# Altium project VNA_CHANNEL.PrjPcb
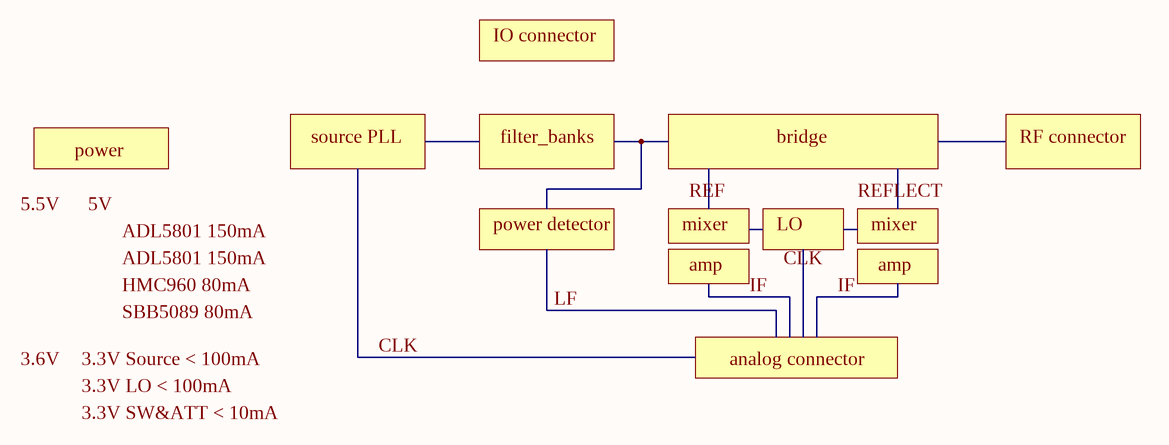
[diagram p0: block_diagram.SchDoc]
7 sheets, 186 parts. Net scope: flat (ports and power ports of the same name join across sheets).
Board file: VNA_CHANNEL.PcbDoc
Sheets:
  block_diagram.SchDoc
  power.SchDoc
  connector.SchDoc
  source.SchDoc
  filterbank_amp.SchDoc
  mixer.SchDoc
  IF_AMP.SchDoc

## Sheet block_diagram.SchDoc
size A4

### Notes on the sheet
- IO connector
- power
- source PLL
- filter_banks
- bridge
- RF connector
- 5.5V
- 5V
- ADL5801 150mA
- power detector
- mixer
- REF
- LO
- CLK
- REFLECT
- HMC960 80mA
- SBB5089 80mA
- LF
- amp
- IF
- 3.6V
- 3.3V Source < 100mA
- 3.3V LO < 100mA
- analog connector
- 3.3V SW&ATT < 10mA

## Sheet power.SchDoc
size A4
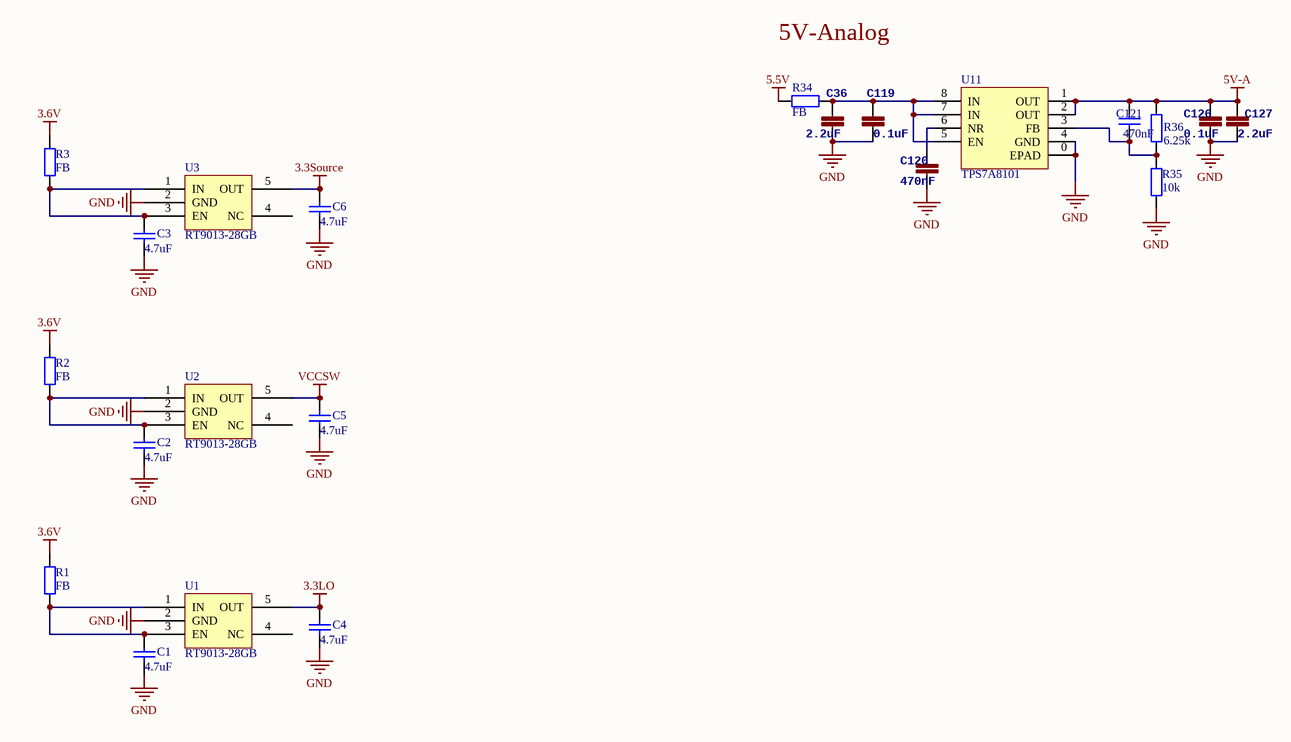
[diagram p1: power.SchDoc]

### Parts
C1  4.7uF  [0603L]
C2  4.7uF  [0603L]
C3  4.7uF  [0603L]
C4  4.7uF  [0603L]
C5  4.7uF  [0603L]
C6  4.7uF  [0603L]
C36  2.2uF  [0603L]
C119  0.1uF  [0402]
C120  470nF  [0402]
C121  470nF  [0402]
C126  0.1uF  [0603L]
C127  2.2uF  [0603L]
R1  FB  [0603L]
R2  FB  [0603L]
R3  FB  [0603L]
R34  FB  [0603L]
R35  10k  [0402]
R36  6.25k  [0402]
U1  RT9013-28GB  [SOT23-5]
U2  RT9013-28GB  [SOT23-5]
U3  RT9013-28GB  [SOT23-5]
U11  TPS7A8101  [TPS7A8101]

### Nets
3.3LO: C4.2 U1.5(OUT)
3.3Source: C6.2 U3.5(OUT)
3.6V: R1.2 R2.2 R3.2
5.5V: R34.2
5V-A: C121.1 C126.2 C127.2 R36.1 U11.1(OUT) U11.2(OUT)
GND: C1.1 C2.1 C3.1 C4.1 C5.1 C6.1 C36.1 C119.1 C120.1 C126.1 C127.1 R35.2 U1.2(GND) U2.2(GND) U3.2(GND) U11.0(EPAD) U11.4(GND)
VCCSW: C5.2 U2.5(OUT)
NetC1_2: C1.2 R1.1 U1.1(IN) U1.3(EN)
NetC2_2: C2.2 R2.1 U2.1(IN) U2.3(EN)
NetC3_2: C3.2 R3.1 U3.1(IN) U3.3(EN)
NetC36_2: C36.2 C119.2 R34.1 U11.5(EN) U11.7(IN) U11.8(IN)
NetC120_2: C120.2 U11.6(NR)
NetC121_2: C121.2 R35.1 R36.2 U11.3(FB)

Not connected (* = marked no-connect by the designer): U1 4(NC); U2 4(NC); U3 4(NC)

### Notes on the sheet
- 5V-Analog

### Library data of the parts
C1-C6 C121 = Cap: Capacitor; Published: 8-Jun-2000; LatestRevisionDate: 17-Jul-2002; LatestRevisionNote: Re-released for DXP Platform.; PackageReference: RAD-0.3; Publisher: Altium Limited; PackageDescription: Radial Cap, Thru-Hole; 2 Leads; 0.3 in Pin Spacing
C36 C119 C120 C126 C127 = CAP0402-CAP: <b>Capacitor</b> / Standard 0603 ceramic capacitor, and 0.1" leaded capacitor.; PARTNO: CC0402ZRY5V7BB104
R1-R3 R34-R36 = Res2: Resistor; Value: 0Ohm; Published: 8-Jun-2000; LatestRevisionDate: 17-Jul-2002; LatestRevisionNote: Re-released for DXP Platform.; PackageReference: AXIAL-0.4; Publisher: Altium Limited; PackageDescription: Axial Device, Thru-Hole; 2 Leads; 0.4 in Pin Spacing
U1-U3 = LP5907

## Sheet connector.SchDoc
size A4
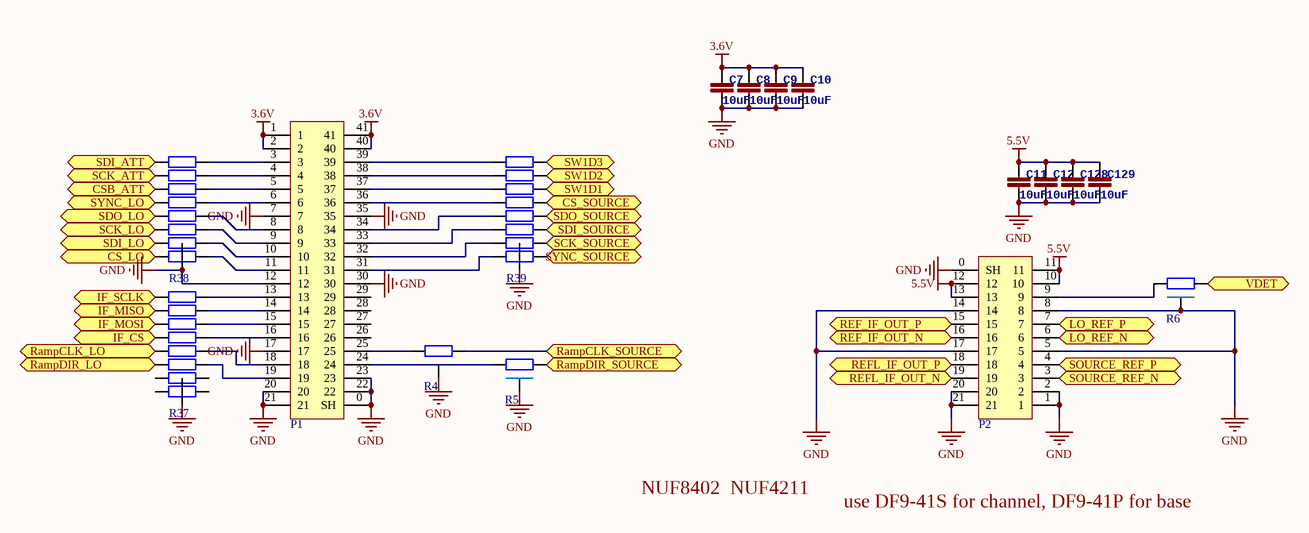
[diagram p2: connector.SchDoc]

### Parts
C7  10uF  [0603L]
C8  10uF  [0603L]
C9  10uF  [0603L]
C10  10uF  [0603L]
C11  10uF  [0603L]
C12  10uF  [0603L]
C128  10uF  [0603L]
C129  10uF  [0603L]
P1  DF9-41S  [DF9-41S]  (value not drawn)
P2  DF9-21  [DF9-21S]  (value not drawn)
R4  PiFilter  [PiFIiter]  (value not drawn)
R5  PiFilter  [PiFIiter]  (value not drawn)
R6  PiFilter  [PiFIiter]  (value not drawn)
R37  NUF8xxx  [NUF8xxx]  (value not drawn)
R38  NUF8xxx  [NUF8xxx]  (value not drawn)
R39  NUF8xxx  [NUF8xxx]  (value not drawn)

### Ports
CS_LO, CS_SOURCE, CSB_ATT, IF_CS, IF_MISO, IF_MOSI, IF_SCLK, LO_REF_N, LO_REF_P, RampCLK_LO, RampCLK_SOURCE, RampDIR_LO, RampDIR_SOURCE, REF_IF_OUT_N, REF_IF_OUT_P, REFL_IF_OUT_N, REFL_IF_OUT_P, SCK_ATT, SCK_LO, SCK_SOURCE, SDI_ATT, SDI_LO, SDI_SOURCE, SDO_LO, SDO_SOURCE, SOURCE_REF_N, SOURCE_REF_P, SW1D1, SW1D2, SW1D3, SYNC_LO, SYNC_SOURCE, VDET

### Nets
3.6V: C7.2 C8.2 C9.2 C10.2 P1.1 P1.2 P1.40 P1.41
5.5V: C11.2 C12.2 C128.2 C129.2 P2.10 P2.11 P2.12 P2.13
GND: C7.1 C8.1 C9.1 C10.1 C11.1 C12.1 C128.1 C129.1 P1.0(SH) P1.7 P1.12 P1.17 P1.20 P1.21 P1.22 P1.23 P1.30 P1.35 P2.0(SH) P2.1 P2.2 P2.5 P2.8 P2.14 P2.17 P2.20 P2.21 R4.3 R5.3 R6.3 R37.0 R38.0 R39.0
REF_IF_OUT_N: P2.16 ; port REF_IF_OUT_N
REF_IF_OUT_P: P2.15 ; port REF_IF_OUT_P
REFL_IF_OUT_N: P2.19 ; port REFL_IF_OUT_N
REFL_IF_OUT_P: P2.18 ; port REFL_IF_OUT_P
SOURCE_REF_N: P2.3 ; port SOURCE_REF_N
SOURCE_REF_P: P2.4 ; port SOURCE_REF_P
NetP1_3: P1.3 R38.16
NetP1_4: P1.4 R38.15
NetP1_5: P1.5 R38.14
NetP1_6: P1.6 R38.13
NetP1_8: P1.8 R38.12
NetP1_9: P1.9 R38.11
NetP1_10: P1.10 R38.10
NetP1_11: P1.11 R38.9
NetP1_13: P1.13 R37.16
NetP1_14: P1.14 R37.15
NetP1_15: P1.15 R37.14
NetP1_16: P1.16 R37.13
NetP1_18: P1.18 R37.12
NetP1_19: P1.19 R37.11
NetP1_24: P1.24 R5.1
NetP1_25: P1.25 R4.2
NetP1_31: P1.31 R39.8
NetP1_32: P1.32 R39.7
NetP1_33: P1.33 R39.6
NetP1_34: P1.34 R39.5
NetP1_36: P1.36 R39.4
NetP1_37: P1.37 R39.3
NetP1_38: P1.38 R39.2
NetP1_39: P1.39 R39.1
NetP2_6: P2.6 ; port LO_REF_N
NetP2_7: P2.7 ; port LO_REF_P
NetP2_9: P2.9 R6.2
NetR4_1: R4.1 ; port RampCLK_SOURCE
NetR5_2: R5.2 ; port RampDIR_SOURCE
NetR6_1: R6.1 ; port VDET
NetR24_2: R37.2 ; port IF_MISO
NetR37_1: R37.1 ; port IF_SCLK
NetR37_3: R37.3 ; port IF_MOSI
NetR37_4: R37.4 ; port IF_CS
NetR37_5: R37.5 ; port RampCLK_LO
NetR37_6: R37.6 ; port RampDIR_LO
NetR38_1: R38.1 ; port SDI_ATT
NetR38_2: R38.2 ; port SCK_ATT
NetR38_3: R38.3 ; port CSB_ATT
NetR38_4: R38.4 ; port SYNC_LO
NetR38_5: R38.5 ; port SDO_LO
NetR38_6: R38.6 ; port SCK_LO
NetR38_7: R38.7 ; port SDI_LO
NetR38_8: R38.8 ; port CS_LO
NetR39_9: R39.9 ; port SYNC_SOURCE
NetR39_10: R39.10 ; port SCK_SOURCE
NetR39_11: R39.11 ; port SDI_SOURCE
NetR39_12: R39.12 ; port SDO_SOURCE
NetR39_13: R39.13 ; port CS_SOURCE
NetR39_14: R39.14 ; port SW1D1
NetR39_15: R39.15 ; port SW1D2
NetR39_16: R39.16 ; port SW1D3

Not connected (* = marked no-connect by the designer): P1 26 27 28 29; R37 7 8 9 10

### Notes on the sheet
- NUF8402  NUF4211
- use DF9-41S for channel, DF9-41P for base

### Library data of the parts
C7-C12 C128 C129 = CAP0402-CAP: as C36 on sheet power

## Sheet source.SchDoc
size A4
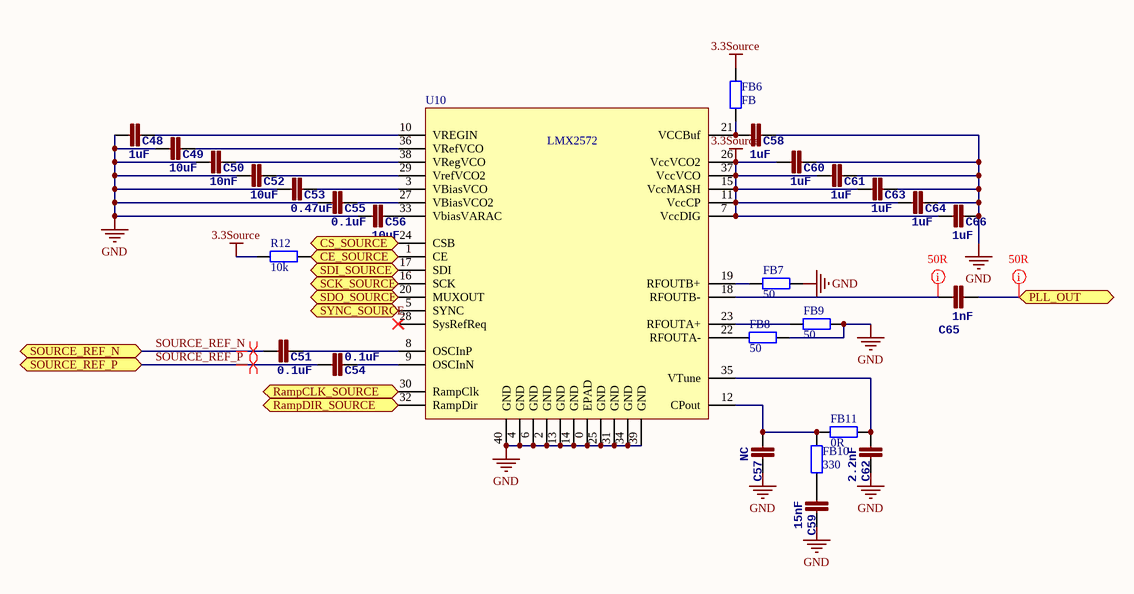
[diagram p3: source.SchDoc]

### Parts
C48  1uF  [0201]
C49  10uF  [0402]
C50  10nF  [0201]
C51  0.1uF  [0201]
C52  10uF  [0402]
C53  0.47uF  [0402]
C54  0.1uF  [0201]
C55  0.1uF  [0201]
C56  10uF  [0402]
C57  NC  [0201]
C58  1uF  [0201]
C59  15nF  [0201]
C60  1uF  [0201]
C61  1uF  [0201]
C62  2.2nF  [0201]
C63  1uF  [0201]
C64  1uF  [0201]
C65  1nF  [0402]
C66  1uF  [0201]
FB6  FB  [0402]
FB7  50  [0201]
FB8  50  [0201]
FB9  50  [0201]
FB10  330  [0201]
FB11  0R  [0201]
R12  10k  [0402]
U10  LMX2572  [LMX2572]

### Ports
CE_SOURCE, CS_SOURCE, PLL_OUT, RampCLK_SOURCE, RampDIR_SOURCE, SCK_SOURCE, SDI_SOURCE, SDO_SOURCE, SOURCE_REF_N, SOURCE_REF_P, SYNC_SOURCE

### Nets
3.3Source: C60.1 C61.1 C63.1 C64.1 C66.1 FB6.1 R12.1 U10.7(VccDIG) U10.11(VccCP) U10.15(VccMASH) U10.26(VccVCO2) U10.37(VccVCO)
GND: C48.1 C49.1 C50.1 C52.1 C53.1 C55.1 C56.1 C57.2 C58.2 C59.2 C60.2 C61.2 C62.2 C63.2 C64.2 C66.2 FB7.1 FB8.1 FB9.1 U10.0(EPAD) U10.2(GND) U10.4(GND) U10.6(GND) U10.13(GND) U10.14(GND) U10.25(GND) U10.31(GND) U10.34(GND) U10.39(GND) U10.40(GND)
SOURCE_REF_N: C51.1 ; port SOURCE_REF_N
SOURCE_REF_P: C54.1 ; port SOURCE_REF_P
NetC48_2: C48.2 U10.10(VREGIN)
NetC49_2: C49.2 U10.36(VRefVCO)
NetC50_2: C50.2 U10.38(VRegVCO)
NetC51_2: C51.2 U10.8(OSCInP)
NetC52_2: C52.2 U10.29(VrefVCO2)
NetC53_2: C53.2 U10.3(VBiasVCO)
NetC54_2: C54.2 U10.9(OSCInN)
NetC55_2: C55.2 U10.27(VBiasVCO2)
NetC56_2: C56.2 U10.33(VbiasVARAC)
NetC57_1: C57.1 FB10.2 FB11.2 U10.12(CPout)
NetC58_1: C58.1 FB6.2 U10.21(VCCBuf)
NetC59_1: C59.1 FB10.1
NetC62_1: C62.1 FB11.1 U10.35(VTune)
NetC65_1: C65.1 U10.18(RFOUTB-)
NetC65_2: C65.2 ; port PLL_OUT
NetFB7_2: FB7.2 U10.19(RFOUTB+)
NetFB8_2: FB8.2 U10.22(RFOUTA-)
NetFB9_2: FB9.2 U10.23(RFOUTA+)
NetR4_1: U10.30(RampClk) ; port RampCLK_SOURCE
NetR5_2: U10.32(RampDir) ; port RampDIR_SOURCE
NetR12_2: R12.2 U10.1(CE) ; port CE_SOURCE
NetR39_9: U10.5(SYNC) ; port SYNC_SOURCE
NetR39_10: U10.16(SCK) ; port SCK_SOURCE
NetR39_11: U10.17(SDI) ; port SDI_SOURCE
NetR39_12: U10.20(MUXOUT) ; port SDO_SOURCE
NetR39_13: U10.24(CSB) ; port CS_SOURCE

Not connected (* = marked no-connect by the designer): U10 28(SysRefReq)*

### Layout directives
net class 50R: NetC65_1, NetC65_2
differential pair: SOURCE_REF_N, SOURCE_REF_P

### Library data of the parts
C48-C66 = CAP0402-CAP: as C36 on sheet power
FB6-FB11 R12 = Res2: Resistor; Published: 8-Jun-2000; LatestRevisionDate: 17-Jul-2002; LatestRevisionNote: Re-released for DXP Platform.; PackageReference: AXIAL-0.4; Publisher: Altium Limited; PackageDescription: Axial Device, Thru-Hole; 2 Leads; 0.4 in Pin Spacing

## Sheet filterbank_amp.SchDoc
size A3
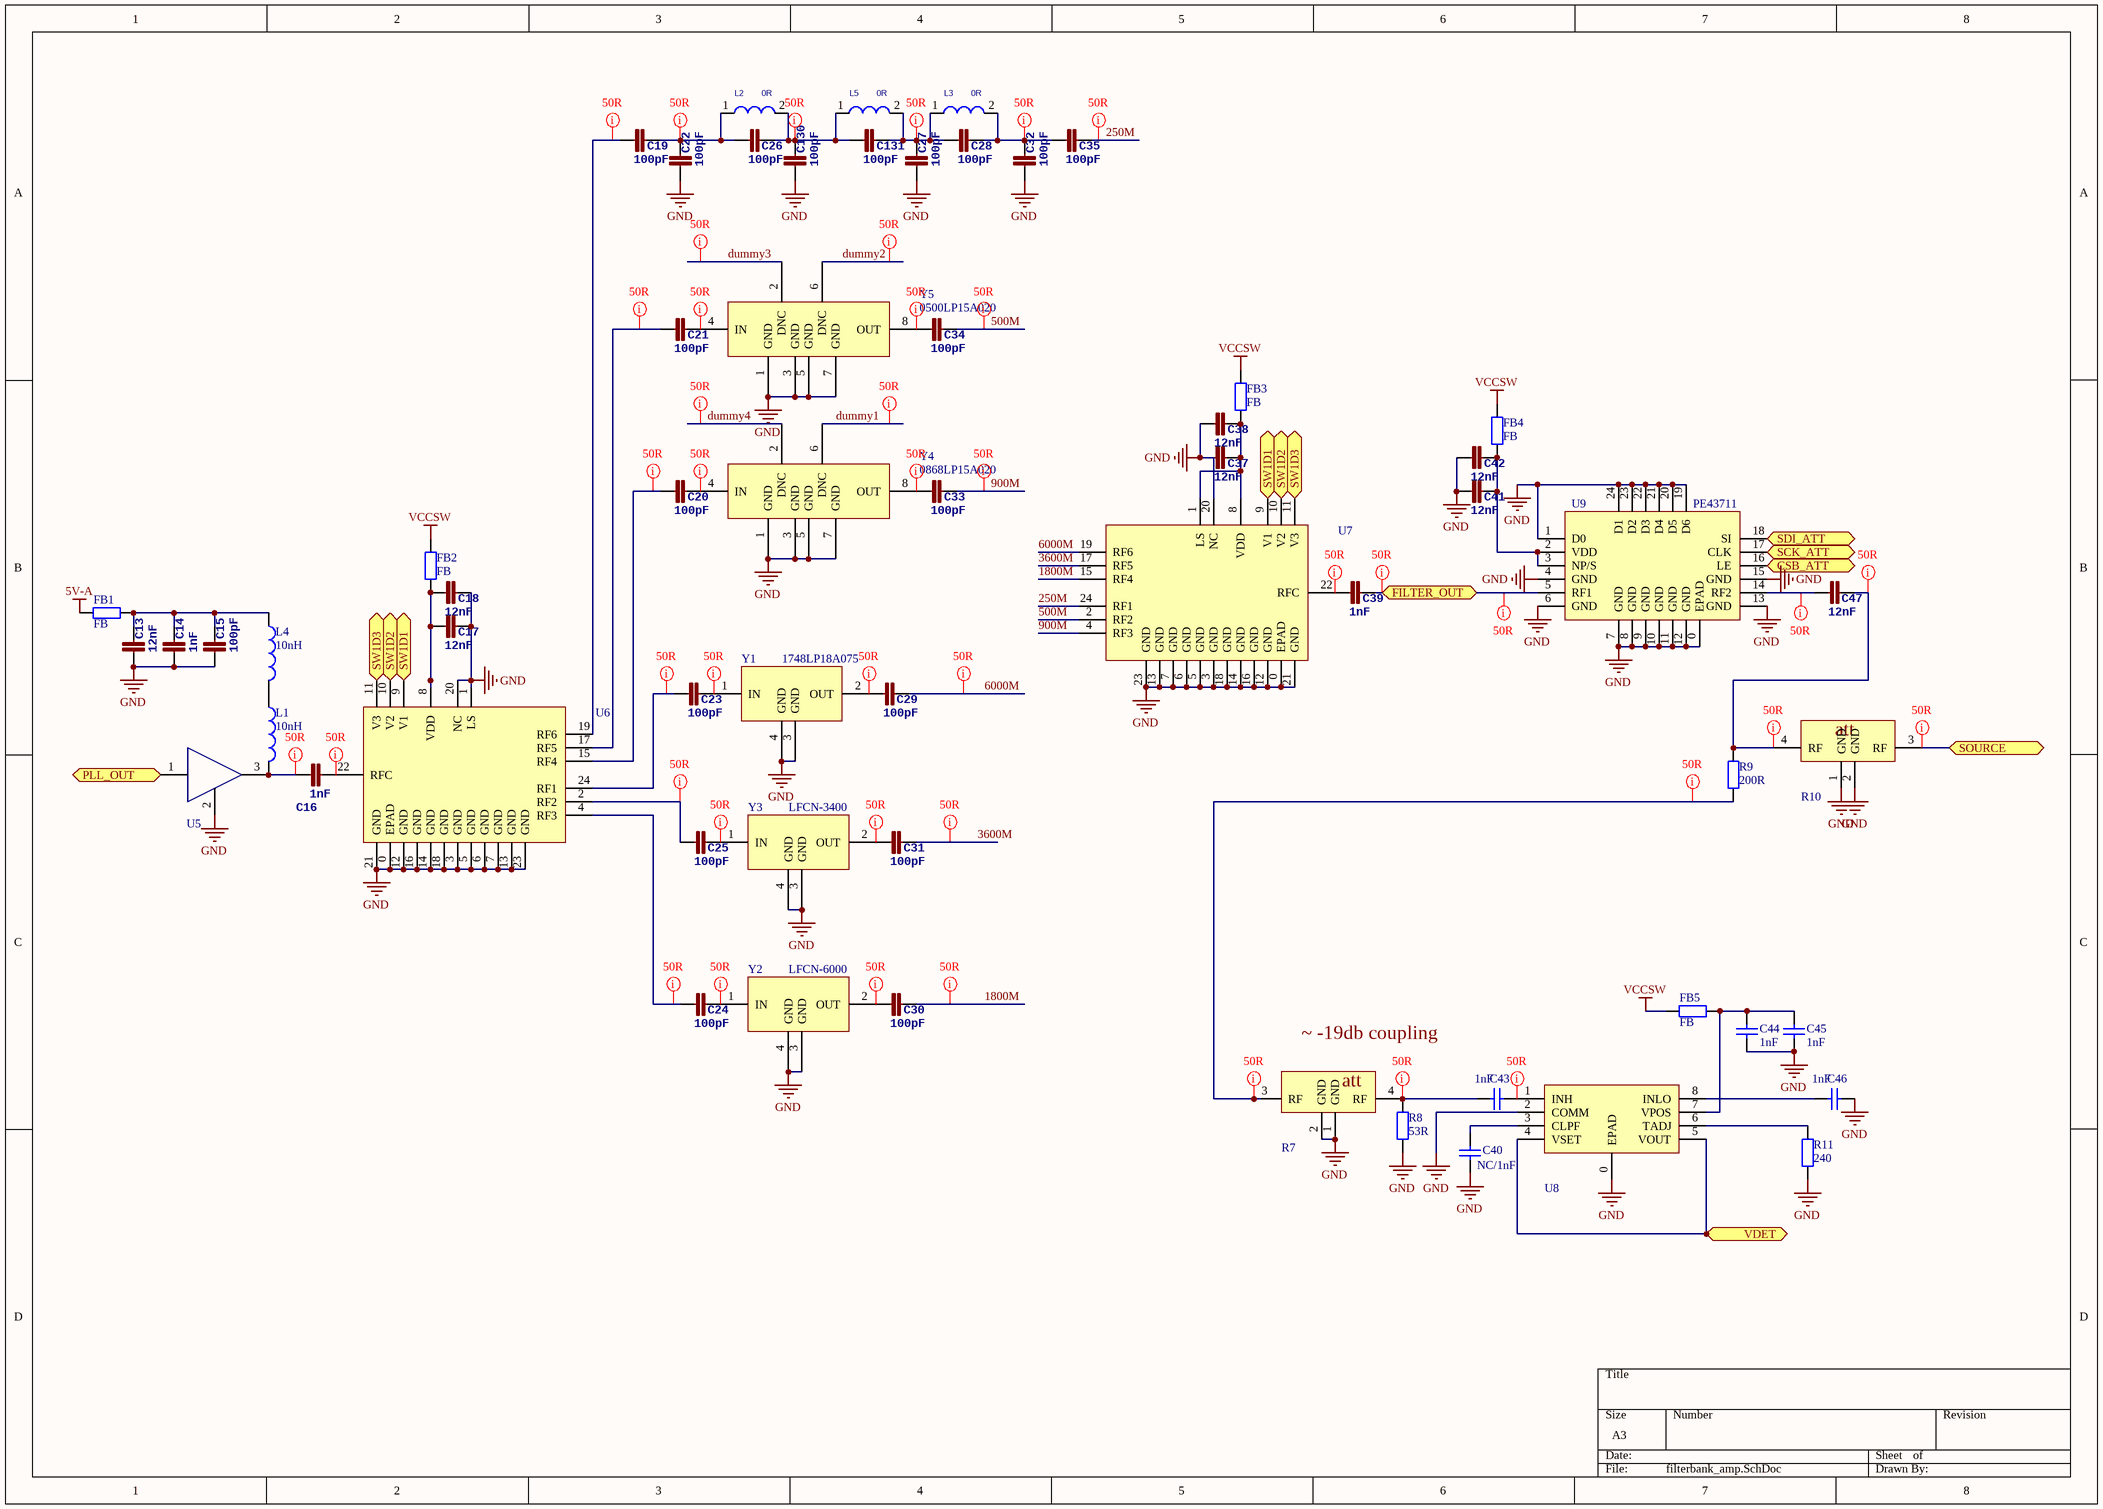
[diagram p4: filterbank_amp.SchDoc]

### Parts
C13  12nF  [0805]
C14  1nF  [0402]
C15  100pF  [0402]
C16  1nF  [0402]
C17  12nF  [0402]
C18  12nF  [0402]
C19  100pF  [0402]
C20  100pF  [0402]
C21  100pF  [0402]
C22  100pF  [0402]
C23  100pF  [0402]
C24  100pF  [0402]
C25  100pF  [0402]
C26  100pF  [0402]
C27  100pF  [0402]
C28  100pF  [0402]
C29  100pF  [0402]
C30  100pF  [0402]
C31  100pF  [0402]
C32  100pF  [0402]
C33  100pF  [0402]
C34  100pF  [0402]
C35  100pF  [0402]
C37  12nF  [0402]
C38  12nF  [0402]
C39  1nF  [0402]
C40  NC/1nF  [0402]
C41  12nF  [0402]
C42  12nF  [0402]
C43  1nF  [0402]
C44  1nF  [0402]
C45  1nF  [0402]
C46  1nF  [0402]
C47  12nF  [0201]
C130  100pF  [0402]
C131  100pF  [0402]
FB1  FB  [0402]
FB2  FB  [0402]
FB3  FB  [0402]
FB4  FB  [0402]
FB5  FB  [0402]
L1  value 10nH  [0402]  (hidden comment: Inductor)
L2  0R  [0402]
L3  0R  [0402]
L4  value 10nH  [0603]  (hidden comment: Inductor)
L5  0R  [0402]
R7  EXB24-RF-ATT  [EXB24AT-RF-ATT]  (value not drawn)
R8  53R  [0402]
R9  200R  [0201]
R10  EXB24-RF-ATT  [EXB24AT-RF-ATT]  (value not drawn)
R11  240  [0402]
U5  AMP-SOT89  [SOT-89]  (value not drawn)
U6  PE42462  [PE42462]  (value not drawn)
U7  PE42462  [PE42462]  (value not drawn)
U8  AD8319  [AD8319]  (value not drawn)
U9  PE43711  [PE43711]
Y1  1748LP18A075  [1748LP18A075]
Y2  LFCN-6000  [1748LP18A075]
Y3  LFCN-3400  [1748LP18A075]
Y4  0868LP15A020  [5515LP15A730/0868LP15A020]
Y5  0500LP15A020  [5515LP15A730/0868LP15A020]

### Ports
CSB_ATT, FILTER_OUT, PLL_OUT, SCK_ATT, SDI_ATT, SOURCE, SW1D1, SW1D2, SW1D3, VDET

### Nets
5V-A: FB1.1
GND: C13.1 C14.1 C15.1 C17.2 C18.2 C22.1 C27.1 C32.1 C37.1 C38.1 C40.1 C41.1 C42.1 C44.1 C45.1 C46.2 C130.1 R7.1(GND) R7.2(GND) R8.2 R10.1(GND) R10.2(GND) R11.2 U5.2 U6.0(EPAD) U6.1(LS) U6.3(GND) U6.5(GND) U6.6(GND) U6.7(GND) U6.12(GND) U6.13(GND) U6.14(GND) U6.16(GND) U6.18(GND) U6.20(NC) U6.21(GND) U6.23(GND) U7.0(EPAD) U7.3(GND) U7.5(GND) U7.6(GND) U7.7(GND) U7.12(GND) U7.13(GND) U7.14(GND) U7.16(GND) U7.18(GND) U7.20(NC) U7.21(GND) U7.23(GND) U8.0(EPAD) U8.2(COMM) U9.0(EPAD) U9.1(D0) U9.4(GND) U9.6(GND) U9.7(GND) U9.8(GND) U9.9(GND) U9.10(GND) U9.11(GND) U9.12(GND) U9.13(GND) U9.15(GND) U9.19(D6) U9.20(D5) U9.21(D4) U9.22(D3) U9.23(D2) U9.24(D1) Y1.3(GND) Y1.4(GND) Y2.3(GND) Y2.4(GND) Y3.3(GND) Y3.4(GND) Y4.1(GND) Y4.3(GND) Y4.5(GND) Y4.7(GND) Y5.1(GND) Y5.3(GND) Y5.5(GND) Y5.7(GND)
VCCSW: FB2.2 FB3.2 FB4.2 FB5.1
250M: C35.2 U7.24(RF1)
500M: C34.2 U7.2(RF2)
900M: C33.2 U7.4(RF3)
1800M: C30.2 U7.15(RF4)
3600M: C31.2 U7.17(RF5)
6000M: C29.2 U7.19(RF6)
dummy1: Y4.6(DNC)
dummy2: Y5.6(DNC)
dummy3: Y5.2(DNC)
dummy4: Y4.2(DNC)
NetC13_2: C13.2 C14.2 C15.2 FB1.2 L4.1
NetC16_1: C16.1 L1.2 U5.3
NetC16_2: C16.2 U6.22(RFC)
NetC17_1: C17.1 C18.1 FB2.1 U6.8(VDD)
NetC19_1: C19.1 U6.19(RF6)
NetC19_2: C19.2 C22.2 C26.1 L2.1
NetC20_1: C20.1 U6.15(RF4)
NetC20_2: C20.2 Y4.4(IN)
NetC21_1: C21.1 U6.17(RF5)
NetC21_2: C21.2 Y5.4(IN)
NetC23_1: C23.1 U6.24(RF1)
NetC23_2: C23.2 Y1.1(IN)
NetC24_1: C24.1 U6.4(RF3)
NetC24_2: C24.2 Y2.1(IN)
NetC25_1: C25.1 U6.2(RF2)
NetC25_2: C25.2 Y3.1(IN)
NetC26_2: C26.2 C130.2 C131.1 L2.2 L5.1
NetC27_2: C27.2 C28.1 C131.2 L3.1 L5.2
NetC28_2: C28.2 C32.2 C35.1 L3.2
NetC29_1: C29.1 Y1.2(OUT)
NetC30_1: C30.1 Y2.2(OUT)
NetC31_1: C31.1 Y3.2(OUT)
NetC33_1: C33.1 Y4.8(OUT)
NetC34_1: C34.1 Y5.8(OUT)
NetC37_2: C37.2 C38.2 FB3.1 U7.1(LS) U7.8(VDD)
NetC39_1: C39.1 U7.22(RFC)
NetC39_2: C39.2 U9.5(RF1) ; port FILTER_OUT
NetC40_2: C40.2 U8.3(CLPF)
NetC41_2: C41.2 C42.2 FB4.1 U9.2(VDD) U9.3(NP/S)
NetC43_1: C43.1 R7.4(RF) R8.1
NetC43_2: C43.2 U8.1(INH)
NetC44_2: C44.2 C45.2 FB5.2 U8.7(VPOS)
NetC46_1: C46.1 U8.8(INLO)
NetC47_1: C47.1 U9.14(RF2)
NetC47_2: C47.2 R9.1 R10.4(RF)
NetC65_2: U5.1 ; port PLL_OUT
NetL1_1: L1.1 L4.2
NetR6_1: U8.4(VSET) U8.5(VOUT) ; port VDET
NetR7_3: R7.3(RF) R9.2
NetR10_3: R10.3(RF) ; port SOURCE
NetR11_1: R11.1 U8.6(TADJ)
NetR38_1: U9.18(SI) ; port SDI_ATT
NetR38_2: U9.17(CLK) ; port SCK_ATT
NetR38_3: U9.16(LE) ; port CSB_ATT
NetR39_14: U6.9(V1) U7.9(V1) ; port SW1D1
NetR39_15: U6.10(V2) U7.10(V2) ; port SW1D2
NetR39_16: U6.11(V3) U7.11(V3) ; port SW1D3

### Layout directives
net class 50R: 250M, 500M, 900M, 1800M, 3600M, 6000M, dummy1, dummy2, dummy3, dummy4, NetC16_1, NetC16_2, NetC19_1, NetC19_2, NetC20_1, NetC20_2, NetC21_1, NetC21_2, NetC23_1, NetC23_2, NetC24_1, NetC24_2, NetC25_1, NetC25_2, NetC26_2, NetC27_2, NetC28_2, NetC29_1, NetC30_1, NetC31_1, NetC33_1, NetC34_1, NetC39_1, NetC39_2, NetC43_1, NetC43_2, NetC47_1, NetC47_2, NetR7_3, NetR10_3

### Notes on the sheet
- ~ -19db coupling
- (in symbol EXB24-RF-ATT) att

### Library data of the parts
C13-C35 C37-C39 C41 C42 C47 C130 C131 = CAP0402-CAP: as C36 on sheet power
C40 C43-C46 = Cap: Capacitor; Published: 8-Jun-2000; LatestRevisionDate: 17-Jul-2002; LatestRevisionNote: Re-released for DXP Platform.; PackageReference: RAD-0.3; Publisher: Altium Limited; PackageDescription: Radial Cap, Thru-Hole; 2 Leads; 0.3 in Pin Spacing
FB1-FB5 R8 R9 R11 = Res2: Resistor; Published: 8-Jun-2000; LatestRevisionDate: 17-Jul-2002; LatestRevisionNote: Re-released for DXP Platform.; PackageReference: AXIAL-0.4; Publisher: Altium Limited; PackageDescription: Axial Device, Thru-Hole; 2 Leads; 0.4 in Pin Spacing
L1 L4 = Inductor: Code_IEC: 1005; Published: 8-Jun-2000; LatestRevisionDate: 29-May-2009; LatestRevisionNote: IPC-7351 Footprint Added.; PackageReference: 0402-A; Publisher: Altium Limited; PackageDescription: Chip Inductor; Code_JEITA: 0402
L2 L3 L5 = L/2.5*2.0
Y2 Y3 = 1748LP18A075
Y4 Y5 = 5515LP15A730/0868LP15A020

## Sheet mixer.SchDoc
size A4
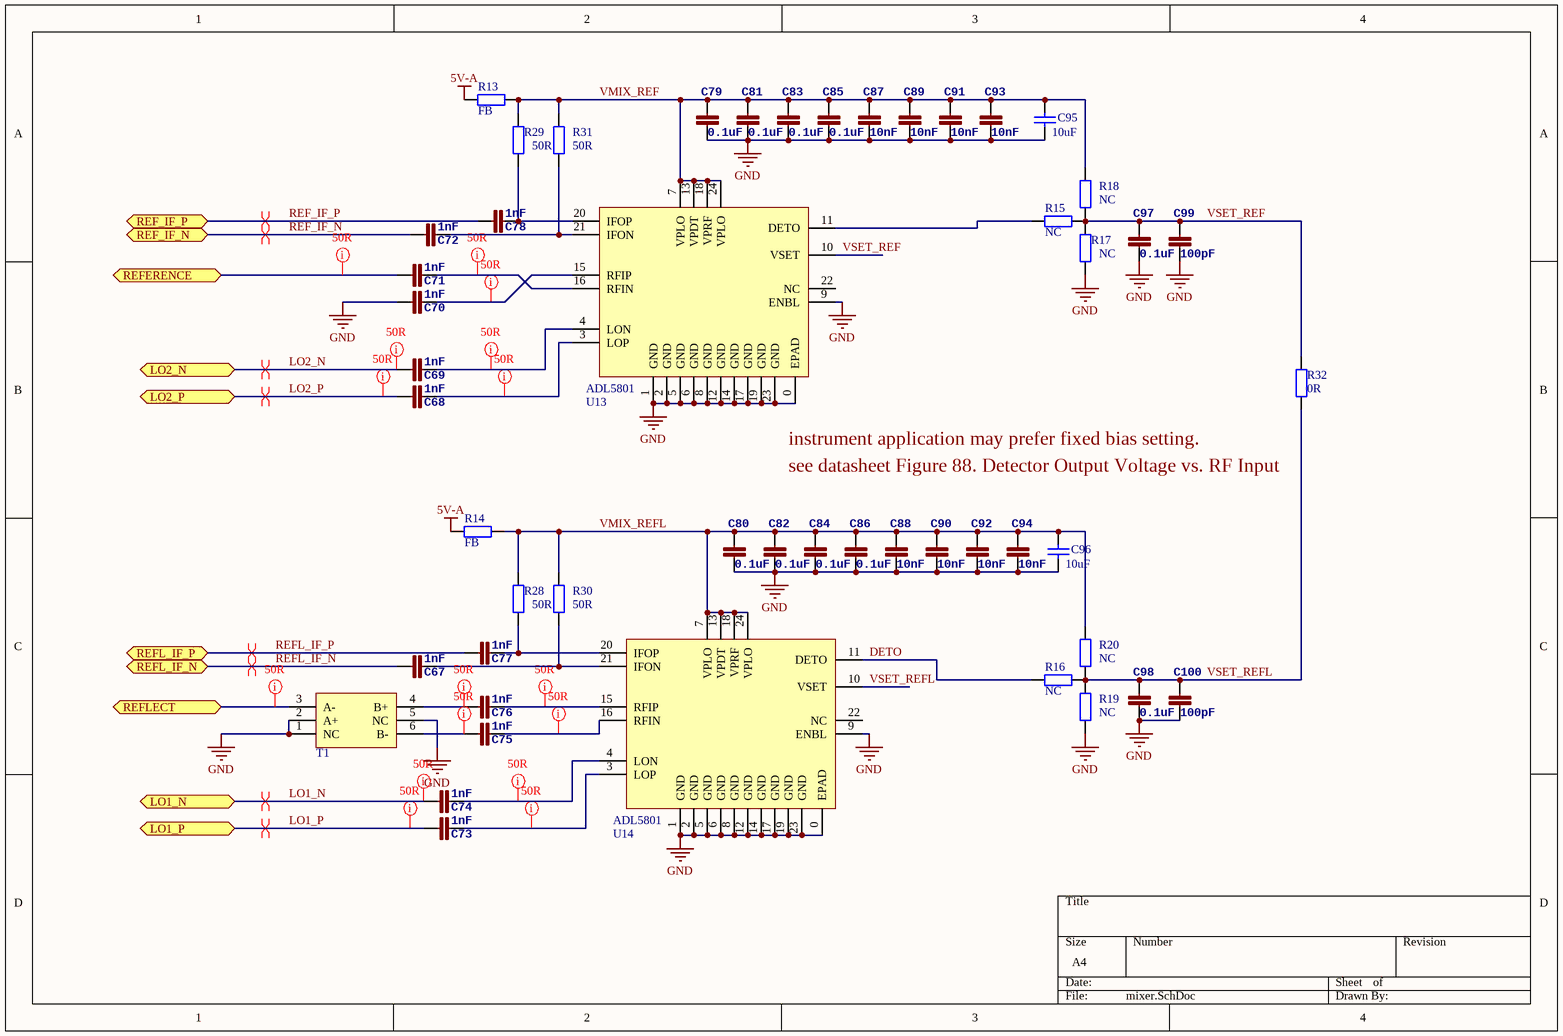
[diagram p5: mixer.SchDoc]

### Parts
C67  1nF  [0402]
C68  1nF  [0402]
C69  1nF  [0402]
C70  1nF  [0402]
C71  1nF  [0402]
C72  1nF  [0402]
C73  1nF  [0402]
C74  1nF  [0402]
C75  1nF  [0402]
C76  1nF  [0402]
C77  1nF  [0402]
C78  1nF  [0402]
C79  0.1uF  [0402]
C80  0.1uF  [0402]
C81  0.1uF  [0402]
C82  0.1uF  [0402]
C83  0.1uF  [0402]
C84  0.1uF  [0402]
C85  0.1uF  [0402]
C86  0.1uF  [0402]
C87  10nF  [0402]
C88  10nF  [0402]
C89  10nF  [0402]
C90  10nF  [0402]
C91  10nF  [0402]
C92  10nF  [0402]
C93  10nF  [0402]
C94  10nF  [0402]
C95  10uF  [0805]
C96  10uF  [0805]
C97  0.1uF  [0402]
C98  0.1uF  [0402]
C99  100pF  [0402]
C100  100pF  [0402]
R13  FB  [0603]
R14  FB  [0603]
R15  NC  [0402]
R16  NC  [0402]
R17  NC  [0402]
R18  NC  [0402]
R19  NC  [0402]
R20  NC  [0402]
R28  50R  [0402]
R29  50R  [0402]
R30  50R  [0402]
R31  50R  [0402]
R32  0R  [0402]
T1  TCM1-63AX+  [TCM1-63AX+]  (value not drawn)
U13  ADL5801  [ADL5801]
U14  ADL5801  [ADL5801]

### Ports
LO1_N, LO1_P, LO2_N, LO2_P, REF_IF_N, REF_IF_P, REFERENCE, REFL_IF_N, REFL_IF_P, REFLECT

### Nets
5V-A: R13.1 R14.1
GND: C70.1 C79.1 C80.1 C81.1 C82.1 C83.1 C84.1 C85.1 C86.1 C87.1 C88.1 C89.1 C90.1 C91.1 C92.1 C93.1 C94.1 C95.1 C96.1 C97.1 C98.1 C99.1 C100.1 R17.1 R19.1 T1.1(NC) T1.2(A+) T1.5(NC) U13.0(EPAD) U13.1(GND) U13.2(GND) U13.5(GND) U13.6(GND) U13.8(GND) U13.9(ENBL) U13.12(GND) U13.14(GND) U13.17(GND) U13.19(GND) U13.23(GND) U14.0(EPAD) U14.1(GND) U14.2(GND) U14.5(GND) U14.6(GND) U14.8(GND) U14.9(ENBL) U14.12(GND) U14.14(GND) U14.17(GND) U14.19(GND) U14.23(GND)
DETO: R16.2 U14.11(DETO)
LO1_N: C74.1 ; port LO1_N
LO1_P: C73.1 ; port LO1_P
LO2_N: C69.1 ; port LO2_N
LO2_P: C68.1 ; port LO2_P
REF_IF_N: C72.1 ; port REF_IF_N
REF_IF_P: C78.1 ; port REF_IF_P
REFL_IF_N: C67.1 ; port REFL_IF_N
REFL_IF_P: C77.1 ; port REFL_IF_P
VMIX_REF: C79.2 C81.2 C83.2 C85.2 C87.2 C89.2 C91.2 C93.2 C95.2 R13.2 R18.2 R29.2 R31.2 U13.7(VPLO) U13.13(VPDT) U13.18(VPRF) U13.24(VPLO)
VMIX_REFL: C80.2 C82.2 C84.2 C86.2 C88.2 C90.2 C92.2 C94.2 C96.2 R14.2 R20.2 R28.2 R30.2 U14.7(VPLO) U14.13(VPDT) U14.18(VPRF) U14.24(VPLO)
VSET_REF: C97.2 C99.2 R15.1 R17.2 R18.1 R32.1 U13.10(VSET)
VSET_REFL: C98.2 C100.2 R16.1 R19.2 R20.1 R32.2 U14.10(VSET)
NetC67_2: C67.2 R30.1 U14.21(IFON)
NetC68_2: C68.2 U13.3(LOP)
NetC69_2: C69.2 U13.4(LON)
NetC70_2: C70.2 U13.15(RFIP)
NetC71_1: C71.1 ; port REFERENCE
NetC71_2: C71.2 U13.16(RFIN)
NetC72_2: C72.2 R31.1 U13.21(IFON)
NetC73_2: C73.2 U14.3(LOP)
NetC74_2: C74.2 U14.4(LON)
NetC75_1: C75.1 T1.6(B-)
NetC75_2: C75.2 U14.16(RFIN)
NetC76_1: C76.1 T1.4(B+)
NetC76_2: C76.2 U14.15(RFIP)
NetC77_2: C77.2 R28.1 U14.20(IFOP)
NetC78_2: C78.2 R29.1 U13.20(IFOP)
NetR15_2: R15.2 U13.11(DETO)
NetT1_3: T1.3(A-) ; port REFLECT

Not connected (* = marked no-connect by the designer): U13 22(NC); U14 22(NC)

### Layout directives
differential pair: LO1_N, LO1_P, LO2_N, LO2_P, REF_IF_N, REF_IF_P, REFL_IF_N, REFL_IF_P
net class 50R: LO1_N, LO1_P, LO2_N, LO2_P, NetC68_2, NetC69_2, NetC70_2, NetC71_1, NetC71_2, NetC73_2, NetC74_2, NetC75_1, NetC75_2, NetC76_1, NetC76_2, NetT1_3

### Notes on the sheet
- instrument application may prefer fixed bias setting.
- see datasheet Figure 88. Detector Output Voltage vs. RF Input

### Library data of the parts
C67-C94 C97-C100 = CAP0402-CAP: as C36 on sheet power
C95 C96 = Cap: Capacitor; Published: 8-Jun-2000; LatestRevisionDate: 17-Jul-2002; LatestRevisionNote: Re-released for DXP Platform.; PackageReference: RAD-0.3; Publisher: Altium Limited; PackageDescription: Radial Cap, Thru-Hole; 2 Leads; 0.3 in Pin Spacing
R13 R14 = Res2: Resistor; Value: 0Ohm; Published: 8-Jun-2000; LatestRevisionDate: 17-Jul-2002; LatestRevisionNote: Re-released for DXP Platform.; PackageReference: AXIAL-0.4; Publisher: Altium Limited; PackageDescription: Axial Device, Thru-Hole; 2 Leads; 0.4 in Pin Spacing
R15-R20 R28-R32 = Res2: Resistor; Published: 8-Jun-2000; LatestRevisionDate: 17-Jul-2002; LatestRevisionNote: Re-released for DXP Platform.; PackageReference: AXIAL-0.4; Publisher: Altium Limited; PackageDescription: Axial Device, Thru-Hole; 2 Leads; 0.4 in Pin Spacing

## Sheet IF_AMP.SchDoc
size A4
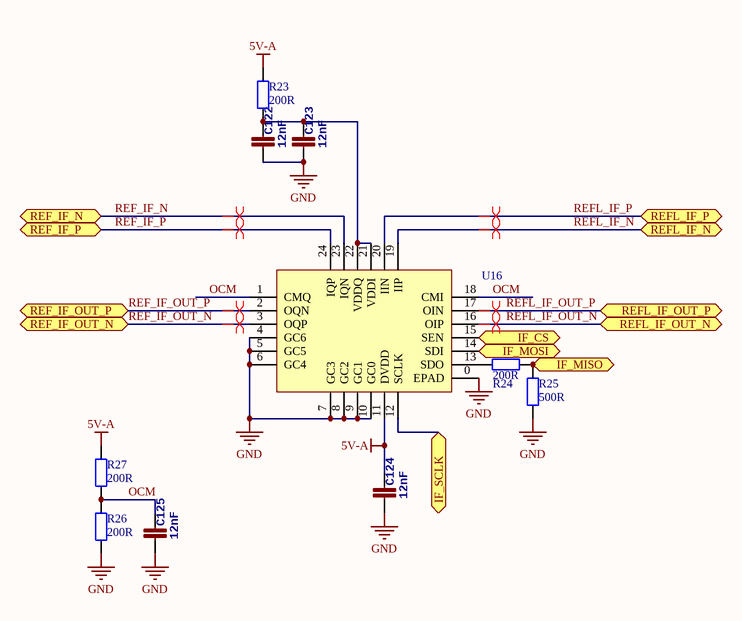
[diagram p6: IF_AMP.SchDoc]

### Parts
C122  12nF  [0402]
C123  12nF  [0402]
C124  12nF  [0402]
C125  12nF  [0402]
R23  200R  [0402]
R24  200R  [0402]
R25  500R  [0402]
R26  200R  [0402]
R27  200R  [0402]
U16  HMC960  [HMC960]  (value not drawn)

### Ports
IF_CS, IF_MISO, IF_MOSI, IF_SCLK, REF_IF_N, REF_IF_OUT_N, REF_IF_OUT_P, REF_IF_P, REFL_IF_N, REFL_IF_OUT_N, REFL_IF_OUT_P, REFL_IF_P

### Nets
5V-A: C124.2 R23.1 R27.1 U16.11(DVDD)
GND: C122.1 C123.1 C124.1 C125.1 R25.1 R26.2 U16.0(EPAD) U16.4(GC6) U16.5(GC5) U16.6(GC4) U16.7(GC3) U16.8(GC2) U16.9(GC1) U16.10(GC0)
OCM: C125.2 R26.1 R27.2 U16.1(CMQ) U16.18(CMI)
REF_IF_N: U16.23(IQN) ; port REF_IF_N
REF_IF_OUT_N: U16.3(OQP) ; port REF_IF_OUT_N
REF_IF_OUT_P: U16.2(OQN) ; port REF_IF_OUT_P
REF_IF_P: U16.24(IQP) ; port REF_IF_P
REFL_IF_N: U16.19(IIP) ; port REFL_IF_N
REFL_IF_OUT_N: U16.16(OIP) ; port REFL_IF_OUT_N
REFL_IF_OUT_P: U16.17(OIN) ; port REFL_IF_OUT_P
REFL_IF_P: U16.20(IIN) ; port REFL_IF_P
NetC122_2: C122.2 C123.2 R23.2 U16.21(VDDI) U16.22(VDDQ)
NetR24_1: R24.1 U16.13(SDO)
NetR24_2: R24.2 R25.2 ; port IF_MISO
NetR37_1: U16.12(SCLK) ; port IF_SCLK
NetR37_3: U16.14(SDI) ; port IF_MOSI
NetR37_4: U16.15(SEN) ; port IF_CS

### Layout directives
differential pair: REF_IF_N, REF_IF_OUT_N, REF_IF_OUT_P, REF_IF_P, REFL_IF_N, REFL_IF_OUT_N, REFL_IF_OUT_P, REFL_IF_P

### Library data of the parts
C122-C125 = CAP0402-CAP: as C36 on sheet power
R23-R27 = Res2: Resistor; Published: 8-Jun-2000; LatestRevisionDate: 17-Jul-2002; LatestRevisionNote: Re-released for DXP Platform.; PackageReference: AXIAL-0.4; Publisher: Altium Limited; PackageDescription: Axial Device, Thru-Hole; 2 Leads; 0.4 in Pin Spacing

## Nets that join several sheets
3.3Source: power (C6.2 U3.5), source (12 pins)
3.6V: power (R1.2 R2.2 R3.2), connector (8 pins)
5.5V: power (R34.2), connector (8 pins)
5V-A: power (6 pins), filterbank_amp (FB1.1), mixer (R13.1 R14.1), IF_AMP (C124.2 R23.1 R27.1 U16.11)
GND: power (17 pins), connector (33 pins), source (30 pins), filterbank_amp (85 pins), mixer (52 pins), IF_AMP (14 pins)
VCCSW: power (C5.2 U2.5), filterbank_amp (FB2.2 FB3.2 FB4.2 FB5.1)
NetC65_2: source (C65.2), filterbank_amp (U5.1)
NetR4_1: connector (R4.1), source (U10.30)
NetR5_2: connector (R5.2), source (U10.32)
NetR6_1: connector (R6.1), filterbank_amp (U8.4 U8.5)
NetR24_2: connector (R37.2), IF_AMP (R24.2 R25.2)
NetR37_1: connector (R37.1), IF_AMP (U16.12)
NetR37_3: connector (R37.3), IF_AMP (U16.14)
NetR37_4: connector (R37.4), IF_AMP (U16.15)
NetR38_1: connector (R38.1), filterbank_amp (U9.18)
NetR38_2: connector (R38.2), filterbank_amp (U9.17)
NetR38_3: connector (R38.3), filterbank_amp (U9.16)
NetR39_9: connector (R39.9), source (U10.5)
NetR39_10: connector (R39.10), source (U10.16)
NetR39_11: connector (R39.11), source (U10.17)
NetR39_12: connector (R39.12), source (U10.20)
NetR39_13: connector (R39.13), source (U10.24)
NetR39_14: connector (R39.14), filterbank_amp (U6.9 U7.9)
NetR39_15: connector (R39.15), filterbank_amp (U6.10 U7.10)
NetR39_16: connector (R39.16), filterbank_amp (U6.11 U7.11)
REF_IF_N: mixer (C72.1), IF_AMP (U16.23)
REF_IF_OUT_N: connector (P2.16), IF_AMP (U16.3)
REF_IF_OUT_P: connector (P2.15), IF_AMP (U16.2)
REF_IF_P: mixer (C78.1), IF_AMP (U16.24)
REFL_IF_N: mixer (C67.1), IF_AMP (U16.19)
REFL_IF_OUT_N: connector (P2.19), IF_AMP (U16.16)
REFL_IF_OUT_P: connector (P2.18), IF_AMP (U16.17)
REFL_IF_P: mixer (C77.1), IF_AMP (U16.20)
SOURCE_REF_N: connector (P2.3), source (C51.1)
SOURCE_REF_P: connector (P2.4), source (C54.1)